# Altium schematic sheet ServoMotor.SchDoc
size A4; SheetNumber: 7
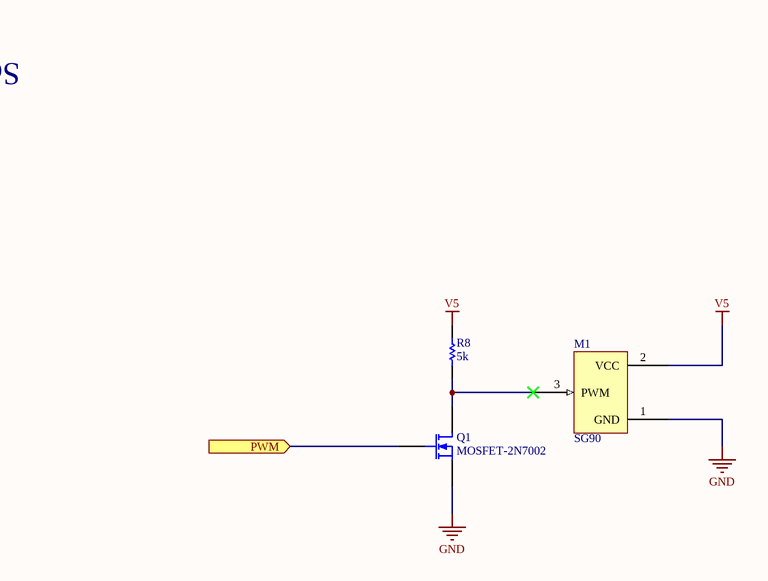
[diagram p0: ServoMotor.SchDoc]

## Parts
M1  SG90  [C-Grid III x3]
Q1  MOSFET-2N7002  [2N7002]
R8  5k  [own_0603]

## Ports
PWM (in)

## Nets
GND: M1.1(GND) Q1.3(S)
V5: M1.2(VCC) R8.2
PWM: Q1.2(G) ; port PWM
NetM1_3: M1.3(PWM) Q1.1(D) R8.1

## Notes on the sheet
- Servomotor

## Library data of the parts
M1 = SG90: Servo motor; Fabricant: Molex; Fournisseur: Farnell; RefFournisseur: 9731156; RefFabricant: 22-27-2031
Q1 = MOSFET-N: N-Channel MOSFET; Fabricant: ON SEMICONDUCTOR; Fournisseur: Farnell; RefFournisseur: 9845313; RefFabricant: 2N7002
R8 = Res1: Resistor; Published: 8-Jun-2000; LatestRevisionDate: 17-Jul-2002; LatestRevisionNote: Re-released for DXP Platform.; PackageReference: AXIAL-0.3; Publisher: Altium Limited; PackageDescription: Axial Device, Thru-Hole; 2 Leads; 0.3 in Pin Spacing